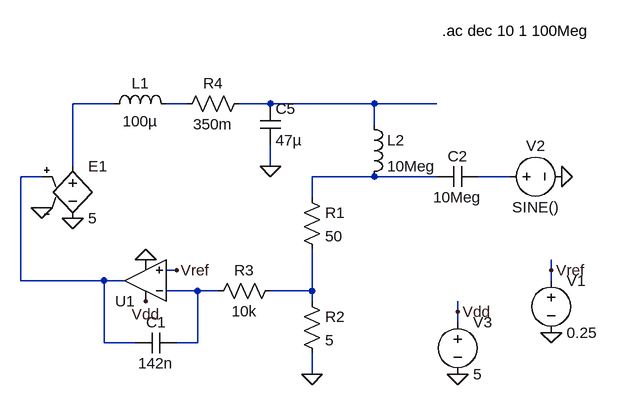
[diagram p0: schematic Module_2 copy.asc]
Module_2 copy.asc, the LTspice schematic file:
Version 4
SHEET 1 1744 1096
WIRE 992 528 928 528
WIRE 1104 528 1072 528
WIRE 1232 528 1184 528
WIRE 1392 528 1232 528
WIRE 1488 528 1392 528
WIRE 1392 560 1392 528
WIRE 928 624 928 528
WIRE 1232 624 1232 592
WIRE 880 640 848 640
WIRE 1392 640 1296 640
WIRE 1488 640 1392 640
WIRE 1600 640 1552 640
WIRE 1296 672 1296 640
WIRE 1088 784 1072 784
WIRE 1664 784 1664 768
WIRE 848 800 848 640
WIRE 976 800 848 800
WIRE 1008 800 976 800
WIRE 1664 800 1664 784
WIRE 1120 816 1072 816
WIRE 1152 816 1120 816
WIRE 1296 816 1296 752
WIRE 1296 816 1232 816
WIRE 1296 832 1296 816
WIRE 1520 848 1520 832
WIRE 1520 864 1520 848
WIRE 976 896 976 800
WIRE 1024 896 976 896
WIRE 1120 896 1120 816
WIRE 1120 896 1088 896
WIRE 1296 944 1296 912
FLAG 1232 624 0
FLAG 1296 944 0
FLAG 1040 768 0
FLAG 880 688 0
FLAG 928 704 0
FLAG 1664 880 0
FLAG 1664 784 Vref
FLAG 1088 784 Vref
FLAG 1680 640 0
FLAG 1520 944 0
FLAG 1520 848 Vdd
FLAG 1040 832 Vdd
SYMBOL cap 1216 528 R0
SYMATTR InstName C5
SYMATTR Value 47µ
SYMBOL ind 976 544 R270
WINDOW 0 32 56 VTop 2
WINDOW 3 5 56 VBottom 2
SYMATTR InstName L1
SYMATTR Value 100µ
SYMBOL res 1200 512 R90
WINDOW 0 0 56 VBottom 2
WINDOW 3 32 56 VTop 2
SYMATTR InstName R4
SYMATTR Value 350m
SYMBOL e 928 608 R0
SYMATTR InstName E1
SYMATTR Value 5
SYMBOL UniversalOpamp2 1040 800 R180
SYMATTR InstName U1
SYMBOL res 1280 656 R0
SYMATTR InstName R1
SYMATTR Value 50
SYMBOL res 1280 816 R0
SYMATTR InstName R2
SYMATTR Value 5
SYMBOL cap 1088 880 R90
WINDOW 0 0 32 VBottom 2
WINDOW 3 32 32 VTop 2
SYMATTR InstName C1
SYMATTR Value 142n
SYMBOL res 1248 800 R90
WINDOW 0 0 56 VBottom 2
WINDOW 3 32 56 VTop 2
SYMATTR InstName R3
SYMATTR Value 10k
SYMBOL ind 1376 544 R0
SYMATTR InstName L2
SYMATTR Value 10Meg
SYMBOL cap 1552 624 R90
WINDOW 0 0 32 VBottom 2
WINDOW 3 32 32 VTop 2
SYMATTR InstName C2
SYMATTR Value 10Meg
SYMBOL voltage 1664 784 R0
SYMATTR InstName V1
SYMATTR Value 0.25
SYMBOL voltage 1584 640 R270
WINDOW 0 32 56 VTop 2
WINDOW 3 -32 56 VBottom 2
SYMATTR InstName V2
SYMATTR Value SINE()
SYMATTR Value2 AC 1
SYMBOL voltage 1520 848 R0
SYMATTR InstName V3
SYMATTR Value 5
TEXT 1496 416 Left 2 !.ac dec 10 1 100Meg

The netlist it stands for:
* Module_2 copy.asc
C5 N003 0 47µ
L1 N001 N002 100µ
R4 N003 N002 350m
E1 N001 0 N004 0 5
XU1 Vref N007 Vdd 0 N004 level.2 Avol=1Meg GBW=10Meg Slew=10Meg ilimit=25m rail=0 Vos=0 phimargin=45 en=0 enk=0 in=0 ink=0 Rin=500Meg  ; pins IN+ IN- V+ V- OUT
R1 N005 N008 50
R2 N008 0 5
C1 N007 N004 142n
R3 N008 N007 10k
L2 N003 N005 10Meg
C2 N006 N005 10Meg
V1 Vref 0 0.25
V2 N006 0 SINE() AC 1
V3 Vdd 0 5
.ac dec 10 1 100Meg
.lib UniversalOpamps2.sub
.backanno
.end